# Altium schematic sheet TOP.SchDoc
size A4; DrawnBy: Dylan Vogel; Organization: UTAT SS; DocumentNumber: 1; Revision: 1.0; SheetNumber: 1; SheetTotal: 8
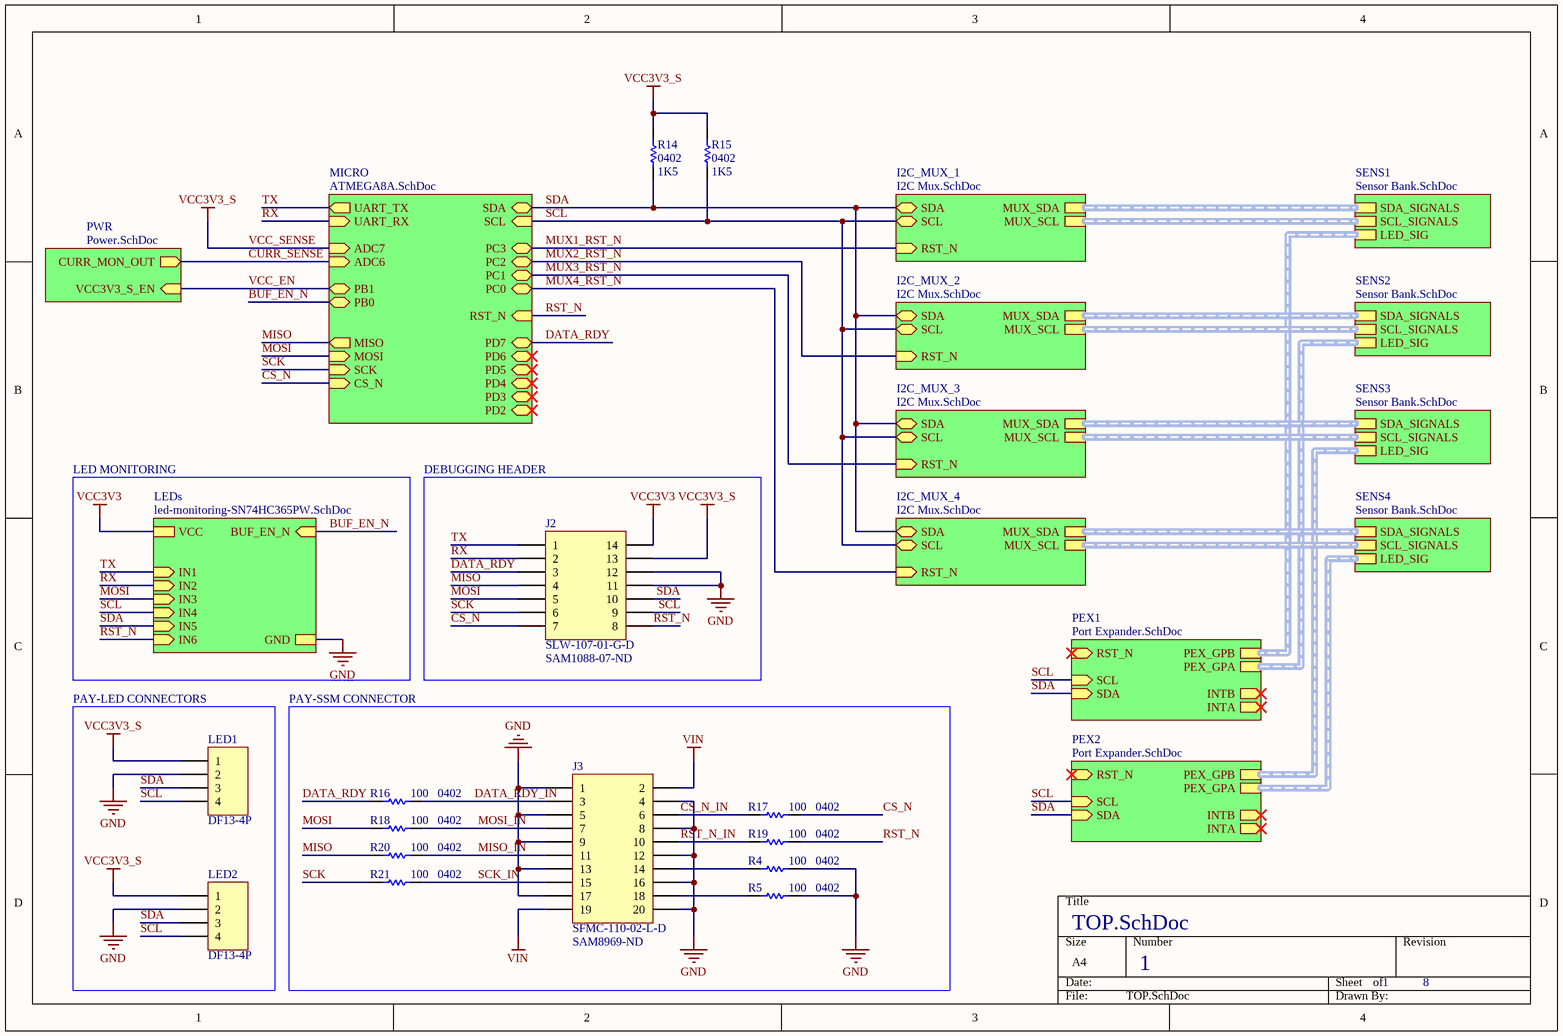
[diagram p0: TOP.SchDoc]

## Parts
J2  SLW-107-01-G-D  Supplier Part Number 1: SAM1088-07-ND  [SLW-107-01-X-D]
J3  SFMC-110-02-L-D  Supplier Part Number 1: SAM8969-ND  [SFMC-110-02-L-D]
LED1  DF13-4P  [DF13A-4P-1.25H(51)]
LED2  DF13-4P  [DF13A-4P-1.25H(51)]
R4  0402  value 100  [RES0402R]
R5  0402  value 100  [RES0402R]
R14  0402  value 1K5  [RES0402R]
R15  0402  value 1K5  [RES0402R]
R16  0402  value 100  [RES0402R]
R17  0402  value 100  [RES0402R]
R18  0402  value 100  [RES0402R]
R19  0402  value 100  [RES0402R]
R20  0402  value 100  [RES0402R]
R21  0402  value 100  [RES0402R]

## Blocks framed on the sheet
DEBUGGING HEADER: J2
PAY-LED CONNECTORS: LED1 LED2
PAY-SSM CONNECTOR: J3 R4 R5 R16-R21

## Sub-sheets
I2C_MUX_1 = I2C Mux.SchDoc: SDA (bidir), SCL (bidir), MUX_SCL (harness MUX_SCL), RST_N (in), MUX_SDA (harness MUX_SDA)  | ADDRESS: 0b000
I2C_MUX_2 = I2C Mux.SchDoc: SDA (bidir), SCL (bidir), MUX_SCL (harness MUX_SCL), RST_N (in), MUX_SDA (harness MUX_SDA)  | ADDRESS: 0b001
I2C_MUX_3 = I2C Mux.SchDoc: SDA (bidir), SCL (bidir), MUX_SCL (harness MUX_SCL), RST_N (in), MUX_SDA (harness MUX_SDA)  | ADDRESS: 0b010
I2C_MUX_4 = I2C Mux.SchDoc: SDA (bidir), SCL (bidir), MUX_SCL (harness MUX_SCL), RST_N (in), MUX_SDA (harness MUX_SDA)  | ADDRESS: 0b011
LEDs = led-monitoring-SN74HC365PW.SchDoc: IN3 (in), IN6 (in), IN4 (in), IN5 (in), GND, VCC, IN1 (in), IN2 (in), BUF_EN_N (in)  | LED1: ORANGE; LED2: ORANGE; LED3: GREEN; LED4: BLUE; LED5: BLUE; LED6: GREEN
MICRO = ATMEGA8A.SchDoc: PC3 (bidir), PB1 (bidir), ADC7 (in), PB0 (bidir), PC0 (bidir), ADC6 (in), PC1 (bidir), MOSI (in), PD2 (bidir), PC2 (bidir), SDA (bidir), PD7 (bidir), PD4 (bidir), MISO (out), PD6 (bidir), UART_RX (in), SCL (in), CS_N (in), RST_N (in), PD5 (bidir), SCK (in), PD3 (bidir), UART_TX (out)
PEX1 = Port Expander.SchDoc: SDA (in), INTA (out), INTB (out), RST_N (in), SCL (in), PEX_GPB (harness PEX_GPB), PEX_GPA (harness PEX_GPA)  | ADDRESS: 0b001
PEX2 = Port Expander.SchDoc: SDA (in), INTA (out), INTB (out), RST_N (in), SCL (in), PEX_GPB (harness PEX_GPB), PEX_GPA (harness PEX_GPA)  | ADDRESS: 0b010
PWR = Power.SchDoc: VCC3V3_S_EN (in), CURR_MON_OUT (out)
SENS1 = Sensor Bank.SchDoc: LED_SIG (harness Harness), SCL_SIGNALS (harness MUX_SCL), SDA_SIGNALS (harness MUX_SDA)
SENS2 = Sensor Bank.SchDoc: LED_SIG (harness Harness), SCL_SIGNALS (harness MUX_SCL), SDA_SIGNALS (harness MUX_SDA)
SENS3 = Sensor Bank.SchDoc: LED_SIG (harness Harness), SCL_SIGNALS (harness MUX_SCL), SDA_SIGNALS (harness MUX_SDA)
SENS4 = Sensor Bank.SchDoc: SCL_SIGNALS (harness MUX_SCL), SDA_SIGNALS (harness MUX_SDA), LED_SIG (harness LED_SIG)

## Nets
GND: J2.6(12) J2.8(11) J3.1 J3.4 J3.5 J3.8 J3.9 J3.12 J3.13 J3.16 J3.17 J3.20 LED1.2 LED2.2 R4.2 R5.2 ; sheet LEDs/GND
VCC3V3: J2.2(14) ; sheet LEDs/VCC
VCC_SENSE: J2.4(13) LED1.1 LED2.1 R14.2 R15.2 ; sheet MICRO/ADC7  [also labelled VCC3V3_S]
VIN: J3.2 J3.19
BUF_EN_N: sheet MICRO/PB0, sheet LEDs/BUF_EN_N
CS_N: J2.13(7) R17.2 ; sheet MICRO/CS_N
CS_N_IN: J3.6 R17.1
CURR_SENSE: sheet MICRO/ADC6, sheet PWR/CURR_MON_OUT
DATA_RDY: J2.5(3) R16.1 ; sheet MICRO/PD7
DATA_RDY_IN: J3.3 R16.2
MISO: J2.7(4) R20.1 ; sheet MICRO/MISO
MISO_IN: J3.11 R20.2
MOSI: J2.9(5) R18.1 ; sheet MICRO/MOSI, sheet LEDs/IN3
MOSI_IN: J3.7 R18.2
MUX1_RST_N: sheet MICRO/PC3, sheet I2C_MUX_1/RST_N
MUX2_RST_N: sheet MICRO/PC2, sheet I2C_MUX_2/RST_N
MUX3_RST_N: sheet MICRO/PC1, sheet I2C_MUX_3/RST_N
MUX4_RST_N: sheet MICRO/PC0, sheet I2C_MUX_4/RST_N
RST_N: J2.14(8) R19.2 ; sheet MICRO/RST_N, sheet LEDs/IN6
RST_N_IN: J3.10 R19.1
RX: J2.3(2) ; sheet MICRO/UART_RX, sheet LEDs/IN2
SCK: J2.11(6) R21.1 ; sheet MICRO/SCK
SCK_IN: J3.15 R21.2
SCL: J2.12(9) LED1.4 LED2.4 R15.1 ; sheet MICRO/SCL, sheet LEDs/IN4, sheet PEX1/SCL, sheet PEX2/SCL, sheet I2C_MUX_1/SCL, sheet I2C_MUX_2/SCL, sheet I2C_MUX_3/SCL, sheet I2C_MUX_4/SCL
SDA: J2.10 LED1.3 LED2.3 R14.1 ; sheet MICRO/SDA, sheet LEDs/IN5, sheet PEX1/SDA, sheet PEX2/SDA, sheet I2C_MUX_1/SDA, sheet I2C_MUX_2/SDA, sheet I2C_MUX_3/SDA, sheet I2C_MUX_4/SDA
TX: J2.1 ; sheet MICRO/UART_TX, sheet LEDs/IN1
VCC_EN: sheet MICRO/PB1, sheet PWR/VCC3V3_S_EN
NetJ3_14: J3.14 R4.1
NetJ3_18: J3.18 R5.1

## Buses and harness runs
harness sheet I2C_MUX_1/MUX_SCL = sheet SENS1/SCL_SIGNALS
harness sheet I2C_MUX_1/MUX_SDA = sheet SENS1/SDA_SIGNALS
harness sheet I2C_MUX_2/MUX_SCL = sheet SENS2/SCL_SIGNALS
harness sheet I2C_MUX_2/MUX_SDA = sheet SENS2/SDA_SIGNALS
harness sheet I2C_MUX_3/MUX_SCL = sheet SENS3/SCL_SIGNALS
harness sheet I2C_MUX_3/MUX_SDA = sheet SENS3/SDA_SIGNALS
harness sheet I2C_MUX_4/MUX_SCL = sheet SENS4/SCL_SIGNALS
harness sheet I2C_MUX_4/MUX_SDA = sheet SENS4/SDA_SIGNALS
harness sheet PEX1/PEX_GPA = sheet SENS2/LED_SIG
harness sheet PEX1/PEX_GPB = sheet SENS1/LED_SIG
harness sheet PEX2/PEX_GPA = sheet SENS4/LED_SIG
harness sheet PEX2/PEX_GPB = sheet SENS3/LED_SIG

## Notes on the sheet
- LED MONITORING

## Library data of the parts
LED1 LED2 = Header 4: Header, 4-Pin; LatestRevisionDate: 17-Jul-2002; LatestRevisionNote: Re-released for DXP Platform.; Publisher: Altium Limited
R4 R5 R14-R21 = Res1: Resistor; Published: 8-Jun-2000; LatestRevisionDate: 17-Jul-2002; LatestRevisionNote: Re-released for DXP Platform.; PackageReference: AXIAL-0.3; Publisher: Altium Limited; PackageDescription: Axial Device, Thru-Hole; 2 Leads; 0.3 in Pin Spacing; Supplier 1: Digi-Key
J2 = SLW-107-01-G-D: Supplier 1: Digi-Key
J3 = SFMC-110-02-L-D: Supplier 1: Digi-Key